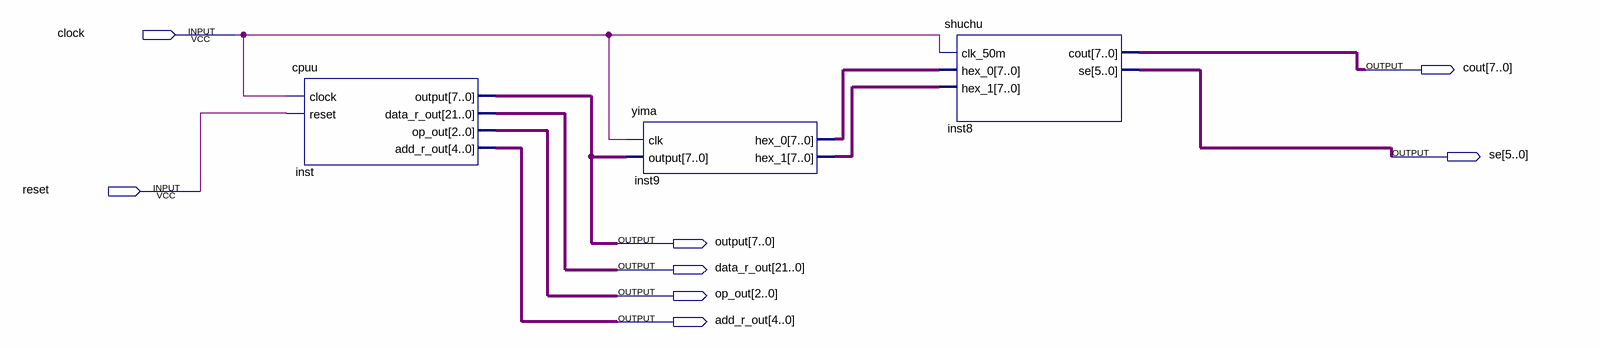
[diagram p0: schematic sheet]
// Quartus schematic cpufz.bdf as structural Verilog: 3 symbols, 8 pins
module cpufz (
  input  clock,
  input  reset,
  output [7:0] cout,
  output [5:0] se,
  output [7:0] \output ,
  output [21:0] data_r_out,
  output [2:0] op_out,
  output [4:0] add_r_out
);

  wire [7:0] inst9_hex_0, inst9_hex_1;

  cpuu inst (
    .clock(clock), .reset(reset), .\output (\output ), .data_r_out(data_r_out), .op_out(op_out),
    .add_r_out(add_r_out));
  yima inst9 (.clk(clock), .\output (\output ), .hex_0(inst9_hex_0), .hex_1(inst9_hex_1));
  shuchu inst8 (.clk_50m(clock), .hex_0(inst9_hex_0), .hex_1(inst9_hex_1), .cout(cout), .se(se));
endmodule
